# Altium project Laser-Harp.PrjPcb
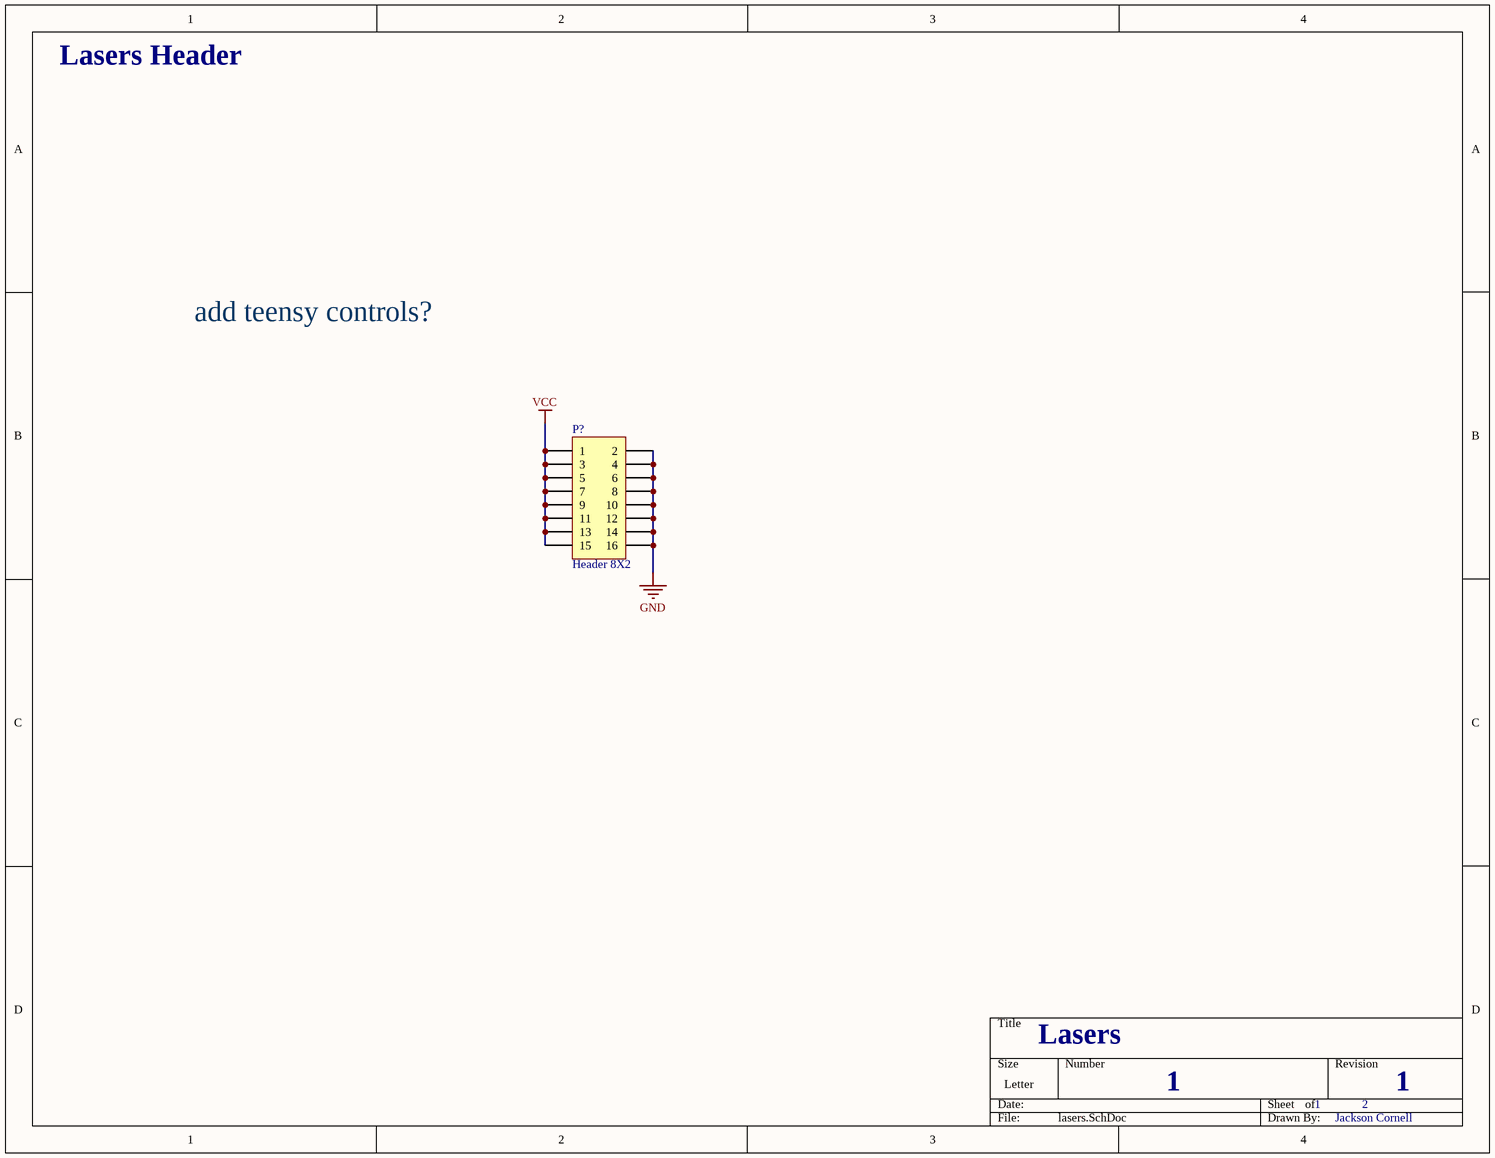
[diagram p0: lasers.SchDoc]
3 sheets, 11 parts. Net scope: global (net labels, ports and power ports of the same name join across sheets).
Sheets:
  lasers.SchDoc
  sensors.SchDoc
  knobs-and-teensy.SchDoc

## Sheet lasers.SchDoc
size Letter

### Parts
(Parts that share a designator on the sheet are numbered #1, #2 ... from top to bottom, then left to right.)
P?#1  Header 8X2  [HDR2X8]

### Nets
GND: P?#1.2 P?#1.4 P?#1.6 P?#1.8 P?#1.10 P?#1.12 P?#1.14 P?#1.16
VCC: P?#1.1 P?#1.3 P?#1.5 P?#1.7 P?#1.9 P?#1.11 P?#1.13 P?#1.15

### Notes on the sheet
- Lasers Header
- add teensy controls?
- Lasers
- 1
- 2
- Jackson Cornell

### Library data of the parts
P?#1 = Header 8X2: Header, 8-Pin, Dual row; LatestRevisionDate: 17-Jul-2002; LatestRevisionNote: Re-released for DXP Platform.; Publisher: Altium Limited

## Sheet sensors.SchDoc
size Letter
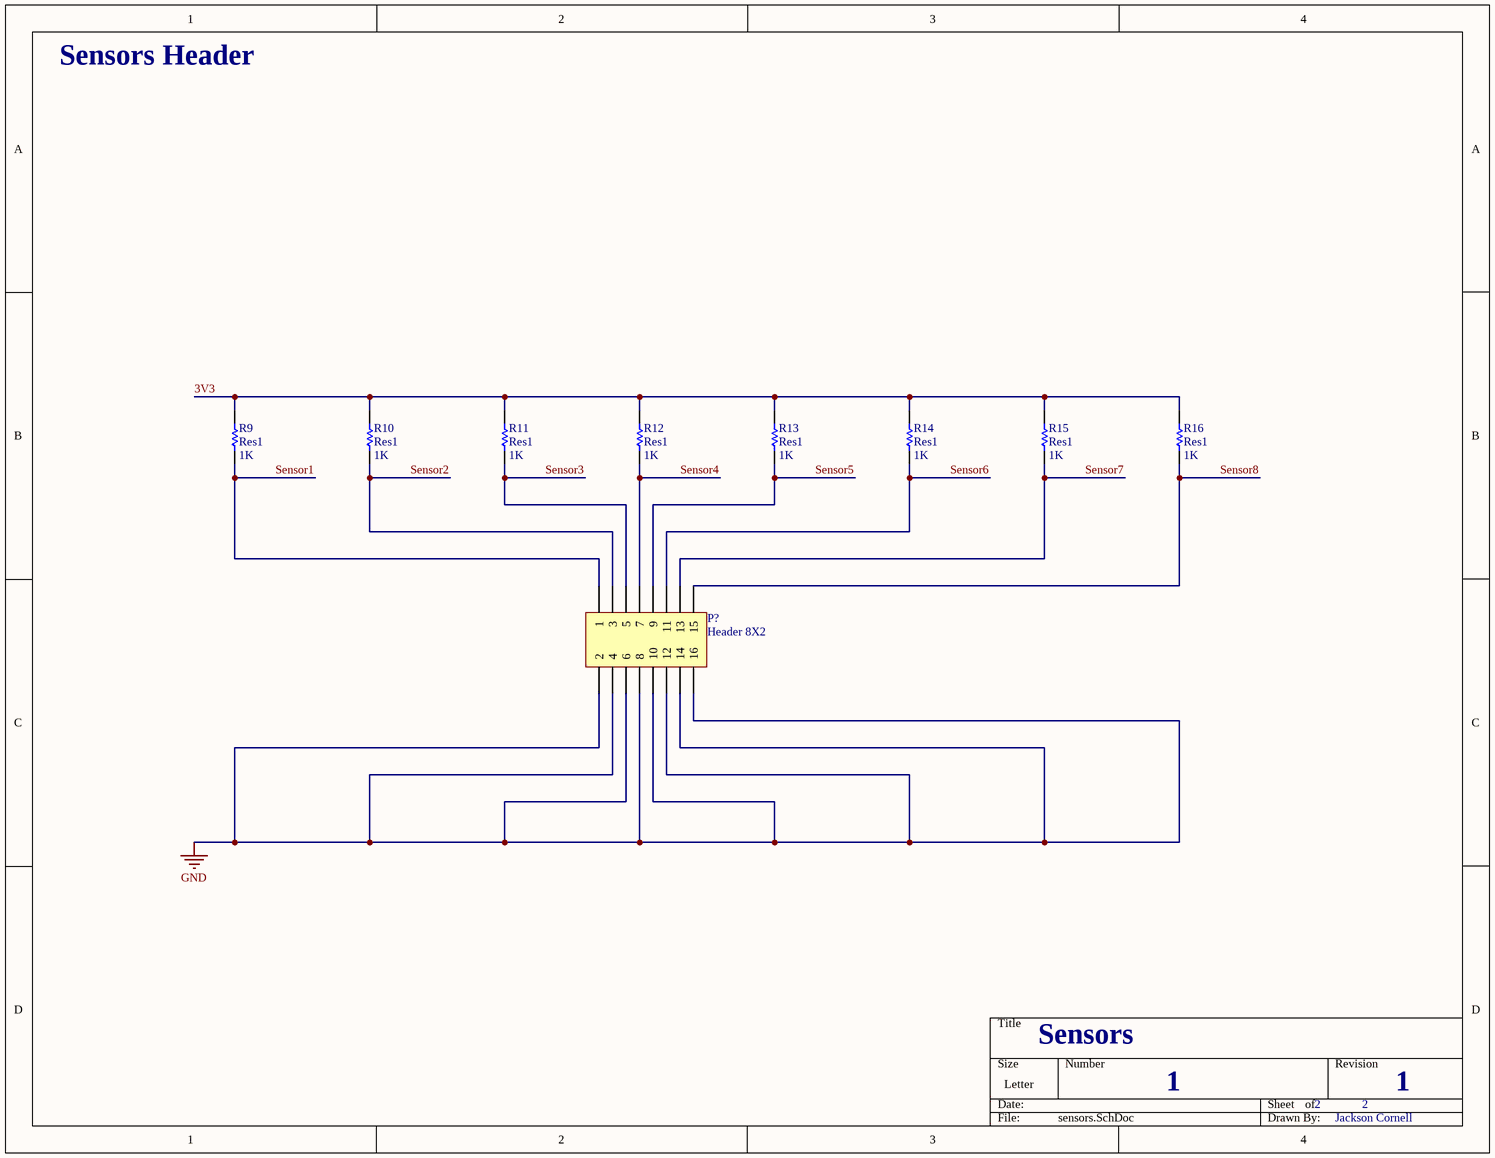
[diagram p1: sensors.SchDoc]

### Parts
(Parts that share a designator on the sheet are numbered #1, #2 ... from top to bottom, then left to right.)
P?#2  Header 8X2  [HDR2X8]
R9  Res1  value 1K  [AXIAL-0.3]
R10  Res1  value 1K  [AXIAL-0.3]
R11  Res1  value 1K  [AXIAL-0.3]
R12  Res1  value 1K  [AXIAL-0.3]
R13  Res1  value 1K  [AXIAL-0.3]
R14  Res1  value 1K  [AXIAL-0.3]
R15  Res1  value 1K  [AXIAL-0.3]
R16  Res1  value 1K  [AXIAL-0.3]

### Nets
GND: P?#2.2 P?#2.4 P?#2.6 P?#2.8 P?#2.10 P?#2.12 P?#2.14 P?#2.16
3V3: R9.2 R10.2 R11.2 R12.2 R13.2 R14.2 R15.2 R16.2
Sensor1: P?#2.1 R9.1
Sensor2: P?#2.3 R10.1
Sensor3: P?#2.5 R11.1
Sensor4: P?#2.7 R12.1
Sensor5: P?#2.9 R13.1
Sensor6: P?#2.11 R14.1
Sensor7: P?#2.13 R15.1
Sensor8: P?#2.15 R16.1

### Notes on the sheet
- Sensors Header
- Sensors
- 1
- 2
- Jackson Cornell

### Library data of the parts
P?#2 = Header 8X2: Header, 8-Pin, Dual row; LatestRevisionDate: 17-Jul-2002; LatestRevisionNote: Re-released for DXP Platform.; Publisher: Altium Limited
R9-R16 = Res1: Resistor; Published: 8-Jun-2000; LatestRevisionDate: 17-Jul-2002; LatestRevisionNote: Re-released for DXP Platform.; PackageReference: AXIAL-0.3; Publisher: Altium Limited; PackageDescription: Axial Device, Thru-Hole; 2 Leads; 0.3 in Pin Spacing

## Sheet knobs-and-teensy.SchDoc
size Letter
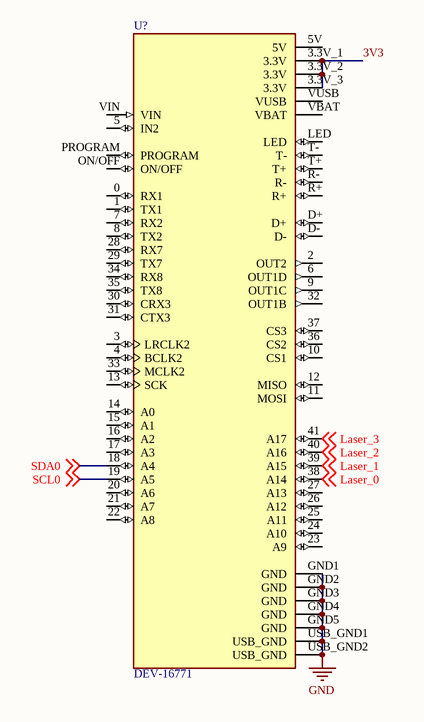
[diagram p2: knobs-and-teensy.SchDoc]

### Parts
U?  DEV-16771  [MODULE_DEV-16771]

### Nets
GND: U?.GND1(GND) U?.GND2(GND) U?.GND3(GND) U?.GND4(GND) U?.GND5(GND) U?.USB_GND1(USB_GND) U?.USB_GND2(USB_GND)
3V3: U?.3.3V_1(3.3V) U?.3.3V_2(3.3V) U?.3.3V_3(3.3V)
Laser_0: U?.38(A14) ; off-sheet Laser_0
Laser_1: U?.39(A15) ; off-sheet Laser_1
Laser_2: U?.40(A16) ; off-sheet Laser_2
Laser_3: U?.41(A17) ; off-sheet Laser_3
SCL0: U?.19(A5) ; off-sheet SCL0
SDA0: U?.18(A4) ; off-sheet SDA0

Not connected (* = marked no-connect by the designer): U? 0(RX1) 1(TX1) 2(OUT2) 3(LRCLK2) 4(BCLK2) 5(IN2) 5V 6(OUT1D) 7(RX2) 8(TX2) 9(OUT1C) 10(CS1) 11(MOSI) 12(MISO) 13(SCK) 14(A0) 15(A1) 16(A2) 17(A3) 20(A6) 21(A7) 22(A8) 23(A9) 24(A10) 25(A11) 26(A12) 27(A13) 28(RX7) 29(TX7) 30(CRX3) 31(CTX3) 32(OUT1B) 33(MCLK2) 34(RX8) 35(TX8) 36(CS2) 37(CS3) D+ D- LED ON/OFF PROGRAM R+ R- T+ T- VBAT VIN VUSB

### Library data of the parts
U? = DEV-16771: RT1062 Teensy 4.1 series ARMÂ® CortexÂ®-M7 MPU Embedded Evaluation Board; MF: SparkFun Electronics; Purchase-URL: https://pricing.snapeda.com/search/part/DEV-16771/?ref=eda; Package: None; Availability: In Stock; SnapEDA_Link: https://www.snapeda.com/parts/DEV-16771/SparkFun+Electronics/view-part/?ref=snap; MP: DEV-16771; Check_prices: https://www.snapeda.com/parts/DEV-16771/SparkFun+Electronics/view-part/?ref=eda; Value: *; Price: None

## Nets that join several sheets
GND: lasers (8 pins), sensors (8 pins), knobs-and-teensy (7 pins)
3V3: sensors (8 pins), knobs-and-teensy (U?.3.3V_1 U?.3.3V_2 U?.3.3V_3)